# Altium schematic sheet 12V-170V Power Boost.SchDoc
size A4
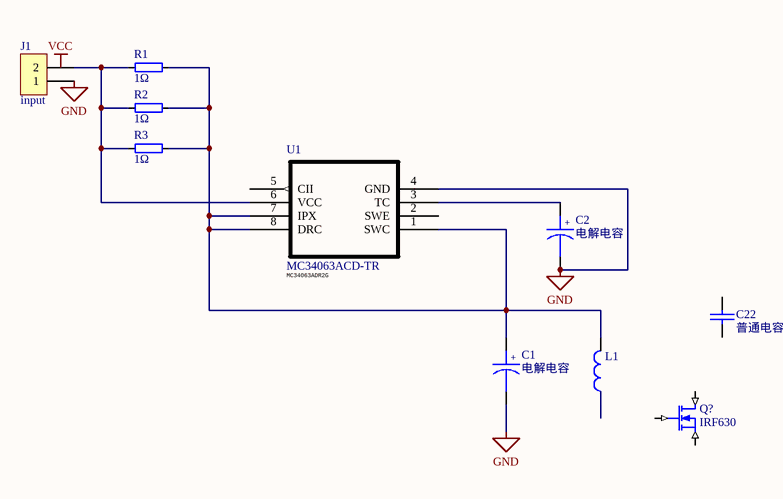
[diagram p0: 12V-170V Power Boost.SchDoc]

## Parts
?  L1
C1  电解电容
C2  电解电容
C22  普通电容  [RAD0.1]
J1  input  [DG1282-5.0]
Q?  IRF630
R1  1Ω  [AXIAL0.3]
R2  1Ω  [AXIAL0.3]
R3  1Ω  [AXIAL0.3]
U1  MC34063ACD-TR  Manufacturer_Part_Number: MC34063ADR2G  [SO-8-M]

## Nets
GND: C1.2 C2.2 J1.1 U1.4(GND)
Net?_1: ?.1 C1.1 R1.2 R2.2 R3.2 U1.1(SWC) U1.7(IPX) U1.8(DRC)
NetC2_1: C2.1 U1.3(TC)
NetJ1_2: J1.2 R1.1 R2.1 R3.1 U1.6(VCC)

Not connected (* = marked no-connect by the designer): ? 2; C22 1 2; Q? 1(D) 2(G) 3(S); U1 2(SWE) 5(CII)

## Notes on the sheet
- Labels drawn without touching a wire or pin: VCC
- (in symbol 电解电容) +

## Library data of the parts
? = L
C1 C2 = 电解电容: Capacitor
C22 = 普通电容: Capacitor
J1 = CON2
Q? = IRF630: N-Channel MOSFET
R1-R3 = RES
U1 = MC34063ACD-TR: Imported